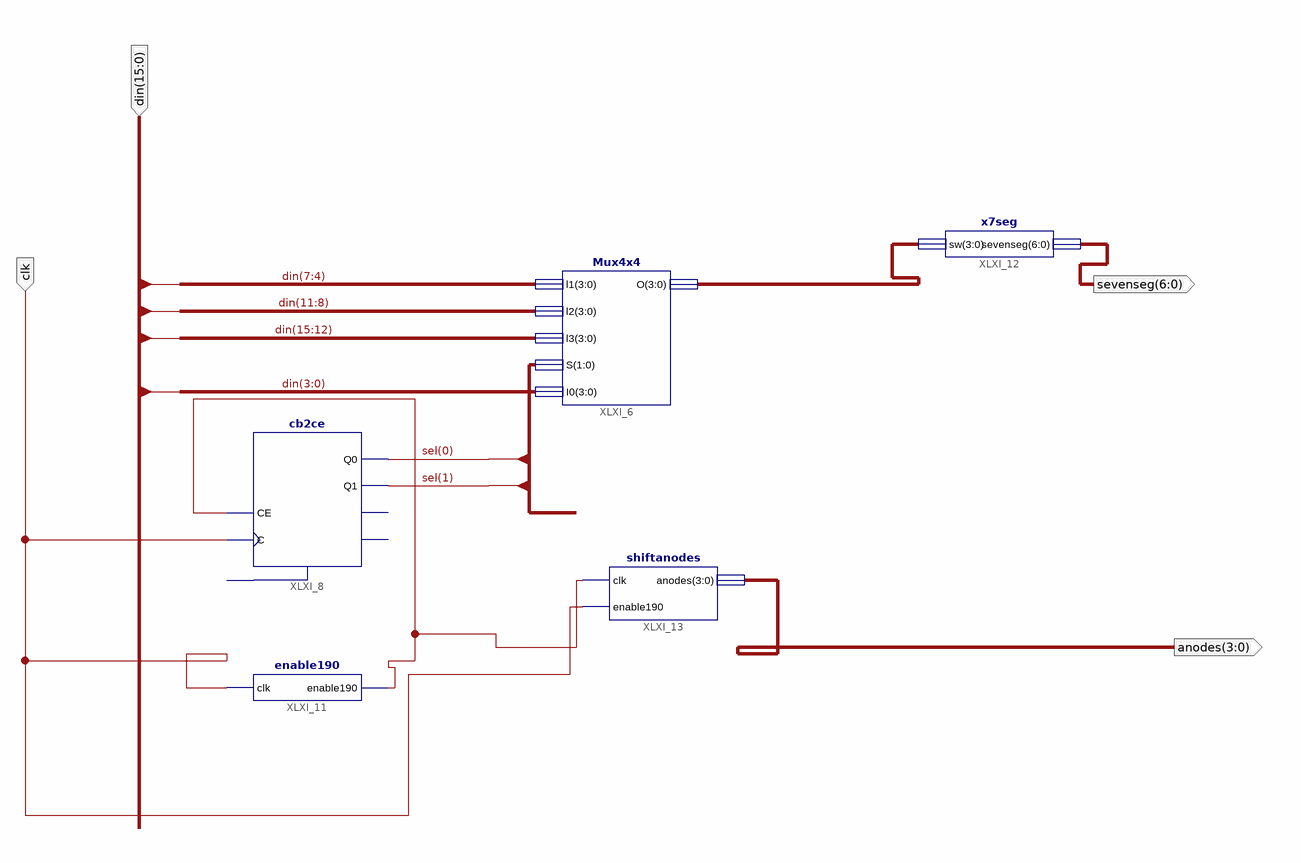
[diagram p0: schematic sheet 1]
// Xilinx ISE schematic afficheur.sch (spartan6) as structural Verilog: 5 symbols, 4 ports
module afficheur (
  input  [15:0] din,
  input  clk,
  output [6:0] sevenseg,
  output [3:0] anodes
);

  wire XLXN_52;
  wire [1:0] sel;
  wire [3:0] XLXN_41;

  Mux4x4 XLXI_6 (.l1(din[7:4]), .l2(din[11:8]), .l3(din[15:12]), .S(sel), .I0(din[3:0]), .O(XLXN_41));
  cb2ce XLXI_8 (.C(clk), .CE(XLXN_52), .Q0(sel[0]), .Q1(sel[1]));  // open: CLR, CEO, TC
  enable190 XLXI_11 (.clk(clk), .enable190(XLXN_52));
  x7seg XLXI_12 (.sw(XLXN_41), .sevenseg(sevenseg));
  shiftanodes XLXI_13 (.clk(XLXN_52), .enable190(clk), .anodes(anodes));
endmodule
